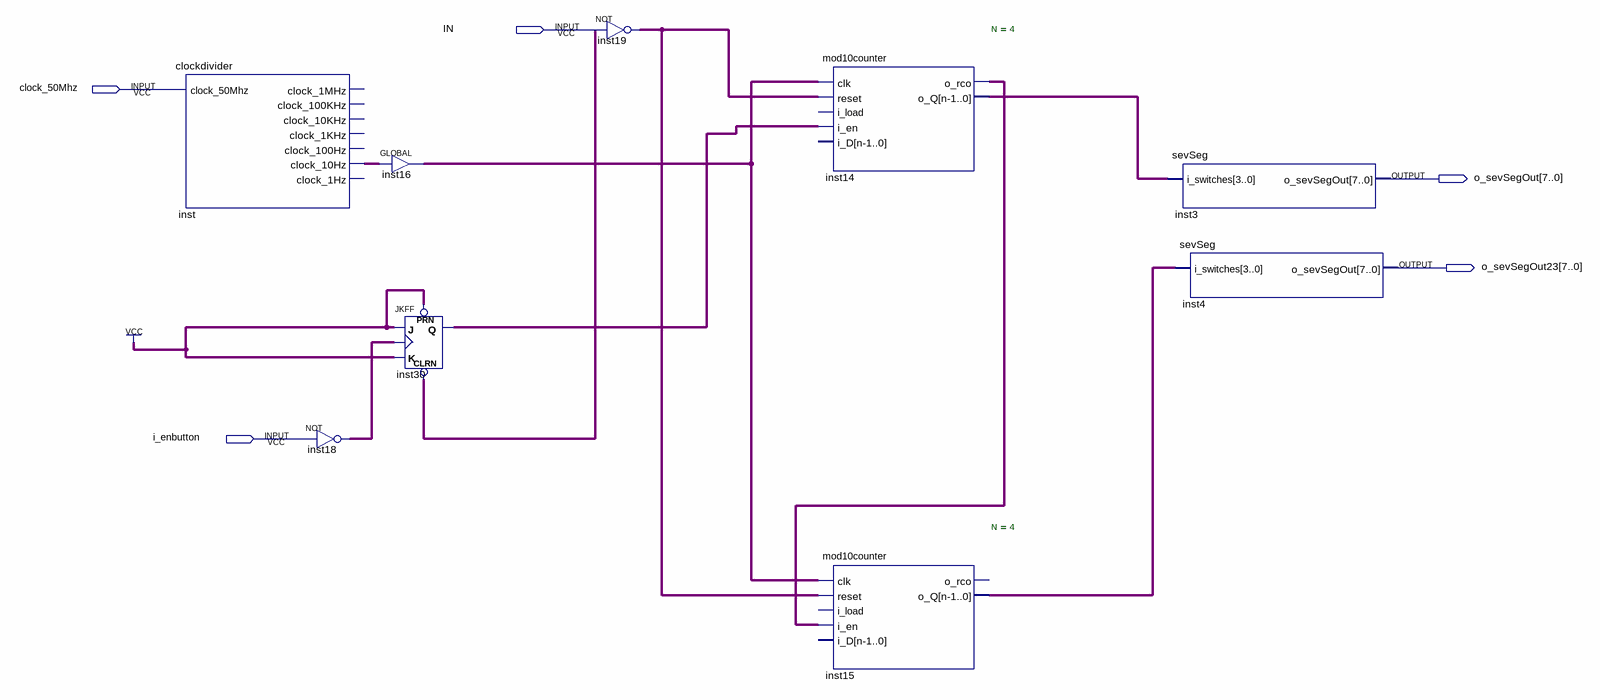
[diagram p0: schematic sheet]
// Quartus schematic stopwatchGraphical.bdf as structural Verilog: 9 symbols, 5 pins
module stopwatchGraphical (
  input  IN,
  input  clock_50Mhz,
  input  i_enbutton,
  output [7:0] o_sevSegOut,
  output [7:0] o_sevSegOut23
);

  wire inst14_o_rco, inst16_out, inst18_out, inst19_out, inst30_q, inst_clock_10hz;
  wire [3:0] inst14_o_q, inst15_o_q;

  clockdivider inst (
    .clock_50Mhz(clock_50Mhz), .clock_10Hz(inst_clock_10hz));  // open: clock_1MHz, clock_100KHz, clock_10KHz, clock_1KHz, clock_100Hz, clock_1Hz
  not inst18 (inst18_out, i_enbutton);
  GLOBAL inst16 (.IN(inst_clock_10hz), .OUT(inst16_out));
  JKFF inst30 (.PRN(1'b1), .CLRN(IN), .K(1'b1), .J(1'b1), .CLK(inst18_out), .Q(inst30_q));
  not inst19 (inst19_out, IN);
  mod10counter #(.N(4)) inst14 (
    .clk(inst16_out), .reset(inst19_out), .i_en(inst30_q), .o_rco(inst14_o_rco), .o_Q(inst14_o_q));  // open: i_load, i_D
  mod10counter #(.N(4)) inst15 (
    .clk(inst16_out), .reset(inst19_out), .i_en(inst14_o_rco), .o_Q(inst15_o_q));  // open: i_load, i_D, o_rco
  sevSeg inst3 (.i_switches(inst14_o_q), .o_sevSegOut(o_sevSegOut));
  sevSeg inst4 (.i_switches(inst15_o_q), .o_sevSegOut(o_sevSegOut23));
endmodule
